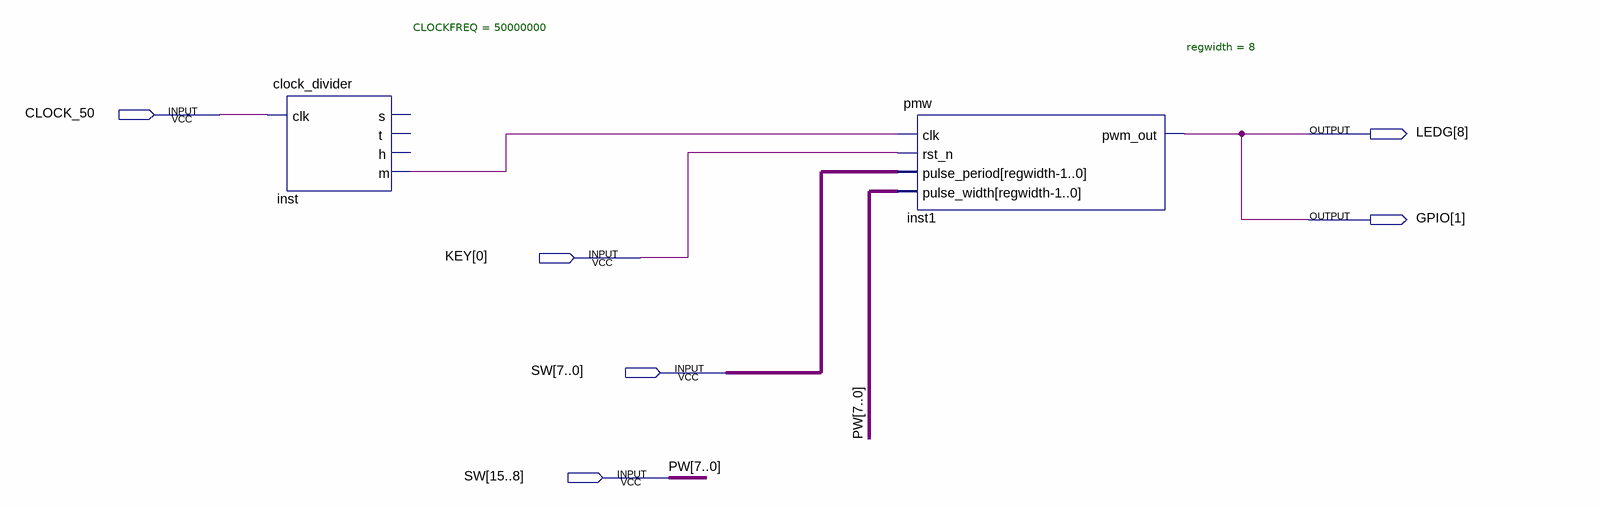
[diagram p0: schematic sheet]
// Quartus schematic PWM_block_diagram.bdf as structural Verilog: 2 symbols, 6 pins
module PWM_block_diagram (
  input  CLOCK_50,
  input  [0:0] KEY,
  input  [15:0] SW,
  output [8:8] LEDG,
  output [1:1] GPIO
);

  wire inst_m;

  clock_divider #(.CLOCKFREQ(50000000)) inst (.clk(CLOCK_50), .m(inst_m));  // open: s, t, h
  pmw #(.regwidth(8)) inst1 (
    .clk(inst_m), .rst_n(KEY[0]), .pulse_period(SW[7:0]), .pulse_width(SW[15:8]), .pwm_out(GPIO[1]));

  assign LEDG[8] = GPIO[1];

  // Other names for the same wires on the sheet: PW[7:0] = SW[15:8]
endmodule
